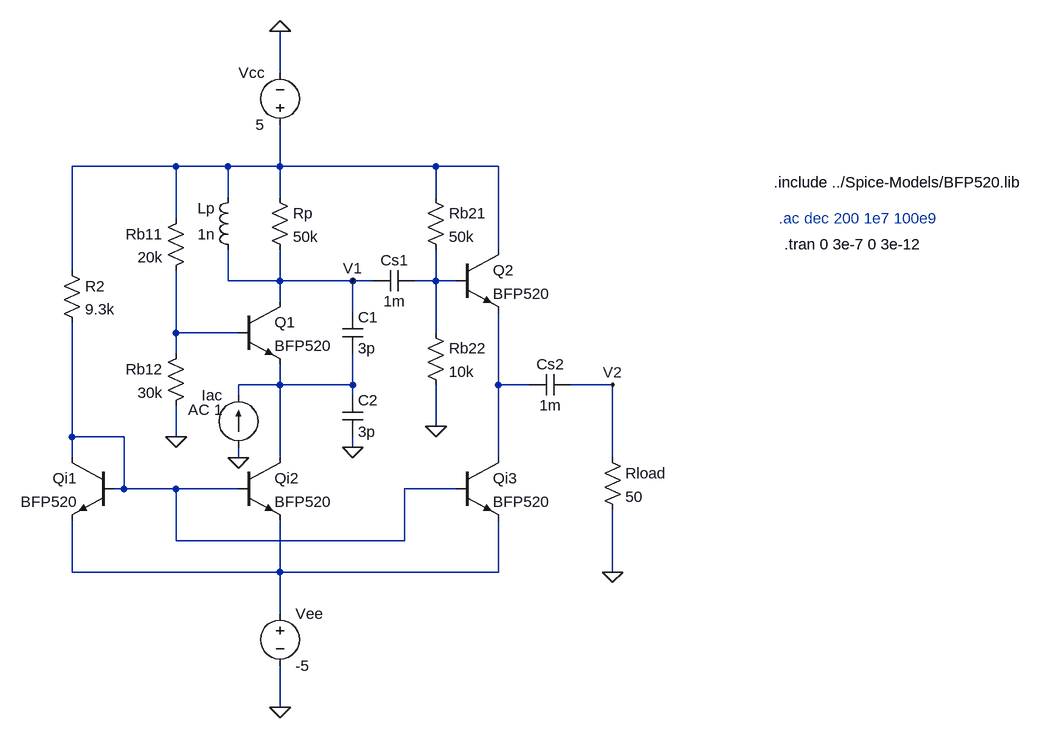
[diagram p0: schematic Draft-DEsign.asc]
Draft-DEsign.asc, the LTspice schematic file:
Version 4
SHEET 1 1604 848
WIRE 464 -144 464 -208
WIRE 304 0 144 0
WIRE 384 0 304 0
WIRE 464 0 464 -64
WIRE 464 0 384 0
WIRE 704 0 464 0
WIRE 800 0 704 0
WIRE 384 48 384 0
WIRE 464 48 464 0
WIRE 704 48 704 0
WIRE 304 80 304 0
WIRE 800 128 800 0
WIRE 144 160 144 0
WIRE 384 176 384 128
WIRE 464 176 464 128
WIRE 464 176 384 176
WIRE 576 176 464 176
WIRE 608 176 576 176
WIRE 704 176 704 128
WIRE 704 176 672 176
WIRE 736 176 704 176
WIRE 464 208 464 176
WIRE 576 224 576 176
WIRE 304 256 304 160
WIRE 400 256 304 256
WIRE 704 256 704 176
WIRE 304 288 304 256
WIRE 464 336 464 304
WIRE 464 336 400 336
WIRE 576 336 576 288
WIRE 576 336 464 336
WIRE 800 336 800 224
WIRE 848 336 800 336
WIRE 976 336 912 336
WIRE 400 352 400 336
WIRE 576 352 576 336
WIRE 704 400 704 336
WIRE 144 416 144 240
WIRE 224 416 144 416
WIRE 304 416 304 368
WIRE 576 432 576 416
WIRE 144 448 144 416
WIRE 400 448 400 432
WIRE 464 448 464 336
WIRE 800 448 800 336
WIRE 976 448 976 336
WIRE 224 496 224 416
WIRE 224 496 208 496
WIRE 304 496 224 496
WIRE 400 496 304 496
WIRE 736 496 656 496
WIRE 304 576 304 496
WIRE 656 576 656 496
WIRE 656 576 304 576
WIRE 144 624 144 544
WIRE 464 624 464 544
WIRE 464 624 144 624
WIRE 800 624 800 544
WIRE 800 624 464 624
WIRE 976 624 976 528
WIRE 464 688 464 624
WIRE 464 832 464 768
FLAG 464 -208 0
FLAG 464 832 0
FLAG 304 416 0
FLAG 704 400 0
FLAG 976 624 0
FLAG 400 448 0
FLAG 576 432 0
FLAG 576 176 V1
FLAG 976 336 V2
SYMBOL npn 400 208 R0
SYMATTR InstName Q1
SYMATTR Value BFP520
SYMBOL ind 400 144 R180
WINDOW 0 36 80 Left 2
WINDOW 3 36 40 Left 2
SYMATTR InstName Lp
SYMATTR Value 1n
SYMBOL Res 448 32 R0
SYMATTR InstName Rp
SYMATTR Value 50k
SYMBOL Voltage 464 -48 R180
WINDOW 0 24 96 Left 2
WINDOW 3 24 16 Left 2
SYMATTR InstName Vcc
SYMATTR Value 5
SYMBOL npn 736 128 R0
SYMATTR InstName Q2
SYMATTR Value BFP520
SYMBOL npn 400 448 R0
SYMATTR InstName Qi2
SYMATTR Value BFP520
SYMBOL npn 208 448 M0
SYMATTR InstName Qi1
SYMATTR Value BFP520
SYMBOL Res 128 144 R0
SYMATTR InstName R2
SYMATTR Value 9.3k
SYMBOL Voltage 464 672 R0
SYMATTR InstName Vee
SYMATTR Value -5
SYMBOL Res 320 64 M0
SYMATTR InstName Rb11
SYMATTR Value 20k
SYMBOL Res 320 272 M0
SYMATTR InstName Rb12
SYMATTR Value 30k
SYMBOL npn 736 448 R0
SYMATTR InstName Qi3
SYMATTR Value BFP520
SYMBOL cap 672 160 R90
WINDOW 0 0 32 VBottom 2
WINDOW 3 32 32 VTop 2
SYMATTR InstName Cs1
SYMATTR Value 1m
SYMBOL Res 688 32 R0
SYMATTR InstName Rb21
SYMATTR Value 50k
SYMBOL Res 688 240 R0
SYMATTR InstName Rb22
SYMATTR Value 10k
SYMBOL Res 960 432 R0
SYMATTR InstName Rload
SYMATTR Value 50
SYMBOL cap 912 320 R90
WINDOW 0 0 32 VBottom 2
WINDOW 3 32 32 VTop 2
SYMATTR InstName Cs2
SYMATTR Value 1m
SYMBOL current 400 432 R180
WINDOW 0 24 80 Left 2
WINDOW 3 24 0 Left 2
WINDOW 123 24 58 Left 2
SYMATTR InstName Iac
SYMATTR Value ""
SYMATTR Value2 AC 1
SYMBOL cap 560 224 R0
SYMATTR InstName C1
SYMATTR Value 3p
SYMBOL cap 560 352 R0
SYMATTR InstName C2
SYMATTR Value 3p
TEXT 1224 24 Left 2 !.include ../Spice-Models/BFP520.lib
TEXT 1232 80 Left 2 ;.ac dec 200 1e7 100e9
TEXT 1240 120 Left 2 !.tran 0 3e-7 0 3e-12

The netlist it stands for:
* Draft-DEsign.asc
Q1 V1 N003 N004 0 BFP520
Lp V1 N001 1n
Rp N001 V1 50k
Vcc N001 0 5
Q2 N001 N002 N005 0 BFP520
Qi2 N004 N006 N007 0 BFP520
Qi1 N006 N006 N007 0 BFP520
R2 N001 N006 9.3k
Vee N007 0 -5
Rb11 N001 N003 20k
Rb12 N003 0 30k
Qi3 N005 N006 N007 0 BFP520
Cs1 N002 V1 1m
Rb21 N001 N002 50k
Rb22 N002 0 10k
Rload V2 0 50
Cs2 V2 N005 1m
Iac 0 N004 AC 1
C1 V1 N004 3p
C2 N004 0 3p
.model NPN NPN
.model PNP PNP
.lib standard.bjt
.include ../Spice-Models/BFP520.lib
* .ac dec 200 1e7 100e9
.tran 0 3e-7 0 3e-12
.backanno
.end